# Altium schematic sheet V1.0.SchDoc
size 101 x 38 mm; PageSetup: Record=PageOptions|CenterHorizontal=True|CenterVertical=True|PrintScale=0.71|XCorrection=1.00|YCorrection=1.00|PrintKind=1|BorderSize=5000000|LeftOffset=0|BottomOffset=0|Orientation=2|PaperLength=1000|PaperWidth=1000|Scale=100|PaperSource=15|PrintQuality=4000|MediaType=1|DitherType=10|PrintScaleMode=1|PaperKind=A4|PaperIndex=9
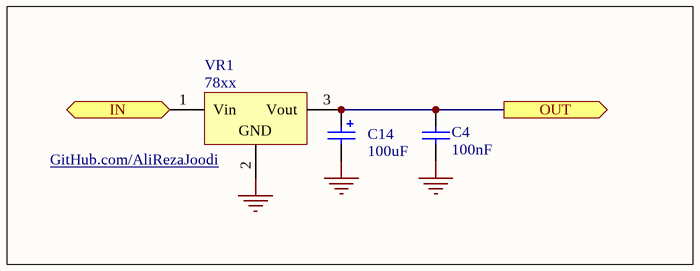
[diagram p0: V1.0.SchDoc]

## Parts
C4  100nF  [CAPNTO2.54-3.05x1.78A]
C14  100uF  [CAPPR2.5-6.3x5]
VR1  78xx  [TO220V]

## Ports
IN (in), OUT (out)

## Nets
GND: C4.1 C14.2 VR1.2(GND)
IN: VR1.1(Vin) ; port IN
OUT: C4.2 C14.1 VR1.3(Vout) ; port OUT

## Notes on the sheet
- (near VR1) GitHub.com/AliRezaJoodi

## Library data of the parts
C4 = Cap: Capacitor; Manufacturer: Generic Components; Class I: Passive; Published: 8-Jun-2000; Revision: July-2002: Re-released for DXP Platform.; Publisher: Altium Limited; Class II: Capacitor
C14 = Cap Pol1: Polarized Capacitor (Radial); Manufacturer: Generic Components; Class I: Passive; Published: 8-Jun-2000; Revision: July-2002: Re-released for DXP Platform.; Publisher: Altium Limited; Class II: Capacitor
VR1 = Volt Reg: Voltage Regulator; Manufacturer: Generic Components; Class I: Power Management; Published: 24-Mar-1999; Revision: July-2002: Re-released for DXP Platform.; Publisher: Altium Limited; Class II: Voltage Regulator